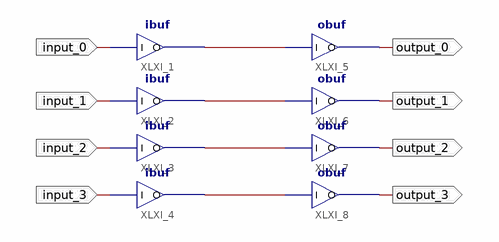
[diagram p0: schematic sheet 1]
// Xilinx ISE schematic T2.sch (spartan3) as structural Verilog: 8 symbols, 8 ports
module T2 (
  input  input_0,
  input  input_1,
  input  input_2,
  input  input_3,
  output output_0,
  output output_1,
  output output_2,
  output output_3
);

  wire XLXN_1, XLXN_3, XLXN_4, XLXN_5;

  ibuf XLXI_1 (.I(input_0), .O(XLXN_1));
  ibuf XLXI_2 (.I(input_1), .O(XLXN_3));
  ibuf XLXI_3 (.I(input_2), .O(XLXN_4));
  ibuf XLXI_4 (.I(input_3), .O(XLXN_5));
  obuf XLXI_5 (.I(XLXN_1), .O(output_0));
  obuf XLXI_6 (.I(XLXN_3), .O(output_1));
  obuf XLXI_7 (.I(XLXN_4), .O(output_2));
  obuf XLXI_8 (.I(XLXN_5), .O(output_3));
endmodule
